# Altium schematic sheet [05] RS485.SchDoc
size A; SheetNumber: 6
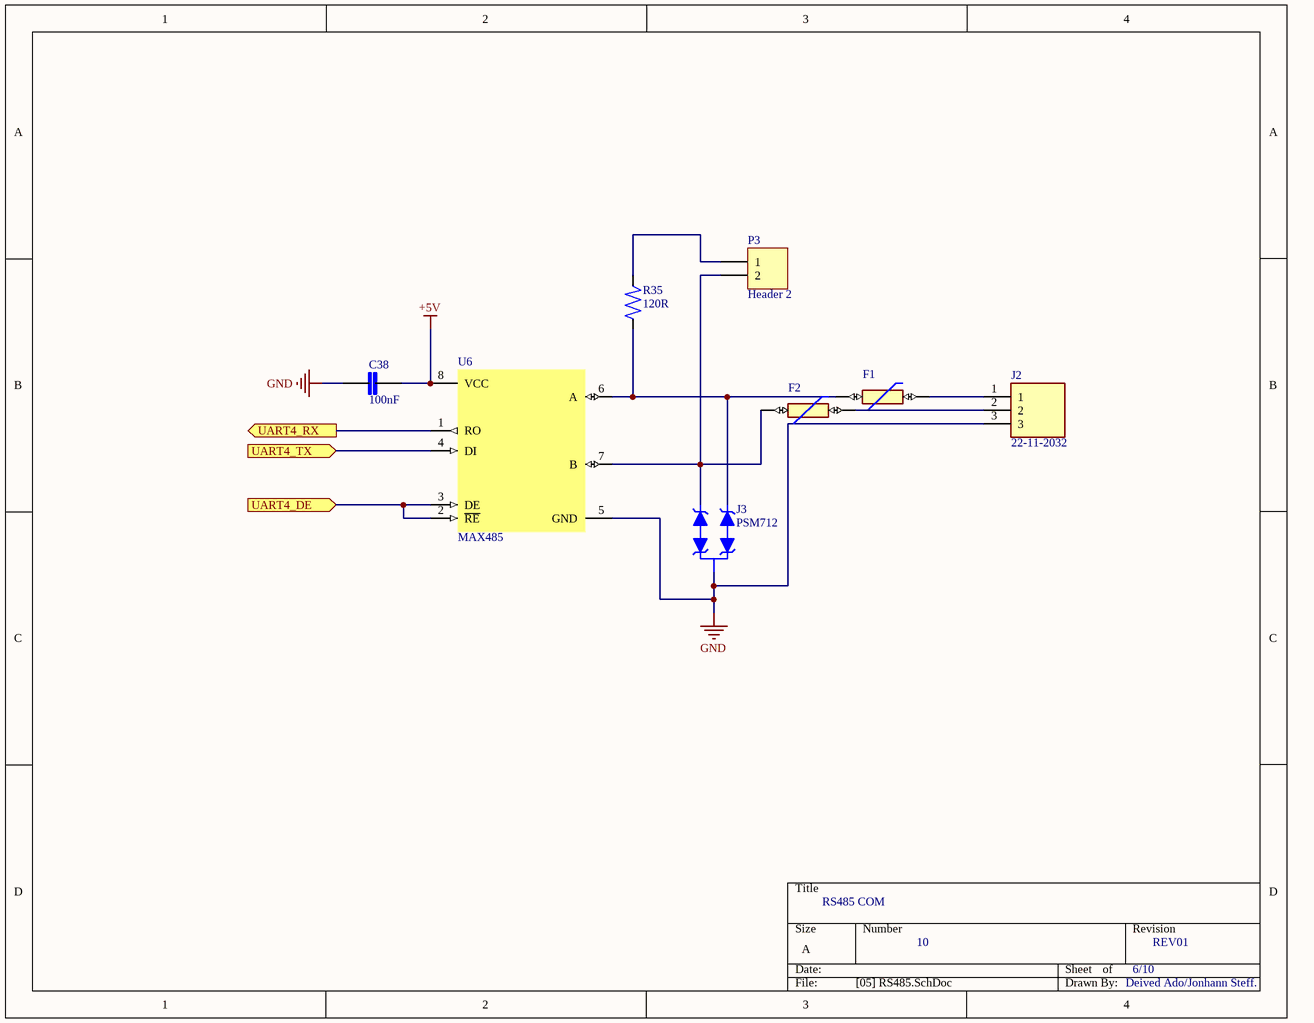
[diagram p0: [05] RS485.SchDoc]

## Parts
C38  100nF  [CAP_0603]
F1  1206L050/15  [RES_1206]  (value not drawn)
F2  1206L050/15  [res_1206]  (value not drawn)
J2  22-11-2032  [HDRV3W87P0X254_1X3_747X635X1105P]
J3  PSM712  [sot-23-3]
P3  Header 2  [HDR1X2]
R35  120R  [RES_0603]
U6  MAX485  [SOIC-8]

## Ports
UART4_DE (in), UART4_RX (out), UART4_TX (in)

## Nets
+5V: C38.2 U6.8(VCC)
GND: C38.1 J2.3 J3.3(C) U6.5(GND)
UART4_DE: U6.2(~{RE}) U6.3(DE) ; port UART4_DE
UART4_RX: U6.1(RO) ; port UART4_RX
UART4_TX: U6.4(DI) ; port UART4_TX
NetF1_1: F1.1 J3.1(A) R35.1 U6.6(A)
NetF1_2: F1.2 J2.1
NetF2_1: F2.1 J3.2(A1) P3.2 U6.7(B)
NetF2_2: F2.2 J2.2
NetP3_1: P3.1 R35.2

## Notes on the sheet
- RS485 COM
- 10
- 6/10
- REV01
- Deived Ado/Jonhann Steff.

## Library data of the parts
C38 = C_Small: Generic capacitor symbol
F1 F2 = 1206L050/15: Polymeric PTC Resettable Fuse 15V 500mA Ih Surface Mount 1206 (3216 Metric), Concave; MF: Littelfuse; Package: None; MP: 1206L050/15; Value: *; Availability: Unavailable; SnapEDA_Link: https://www.snapeda.com/parts/1206L050/15/Littelfuse/view-part/4874799/?ref=snap; Check_prices: https://www.snapeda.com/parts/1206L050/15/Littelfuse/view-part/4874799/?ref=eda; Price: None
J2 = KK - HDR 3P: Molex KK 254 6373, 2.54mm Pitch, 3 Way, 1 Row, Straight PCB Header, Through Hole; Price: 0,63; Purchase-URL: https://www.mouser.co.uk/ProductDetail/Molex/22-11-2032?qs=KHty%2FoMxDPke3knj%252BlB5Gw%3D%3D; Manufacturer: Molex; Mfr. Part #: 22-11-2032; Datasheet: https://tools.molex.com/pdm_docs/sd/022112032_sd.pdf
J3 = PSM712: ESD Suppressor Diode TVS Bi-Dir 12V/7V 3-Pin SOT-23; MF: Texas Instruments; SnapEDA_Link: https://www.snapeda.com/parts/PSM712/Texas+Instruments/view-part/?ref=snap; Package: None; Value: *; MP: PSM712; Check_prices: https://www.snapeda.com/parts/PSM712/Texas+Instruments/view-part/?ref=eda
P3 = Header 2: Header, 2-Pin; LatestRevisionDate: 17-Jul-2002; LatestRevisionNote: Re-released for DXP Platform.; Publisher: Altium Limited
R35 = R_Small: Generic Resistor symbol
U6 = MAX485: Transceiver Half RS422, RS485 8-SOIC; Mfr. Part #: MAX485ESA+; Manufacturer: Analog Devices / Maxim Integrated; Purchase-URL: https://br.mouser.com/ProductDetail/Analog-Devices-Maxim-Integrated/MAX485ESA%2b?qs=1THa7WoU59HHuBnHtoz5mw%3D%3D; Package: SOIC-8 Maxim; Price: 5,27; Datasheet: https://br.mouser.com/datasheet/2/609/MAX1487_MAX491-3129519.pdf